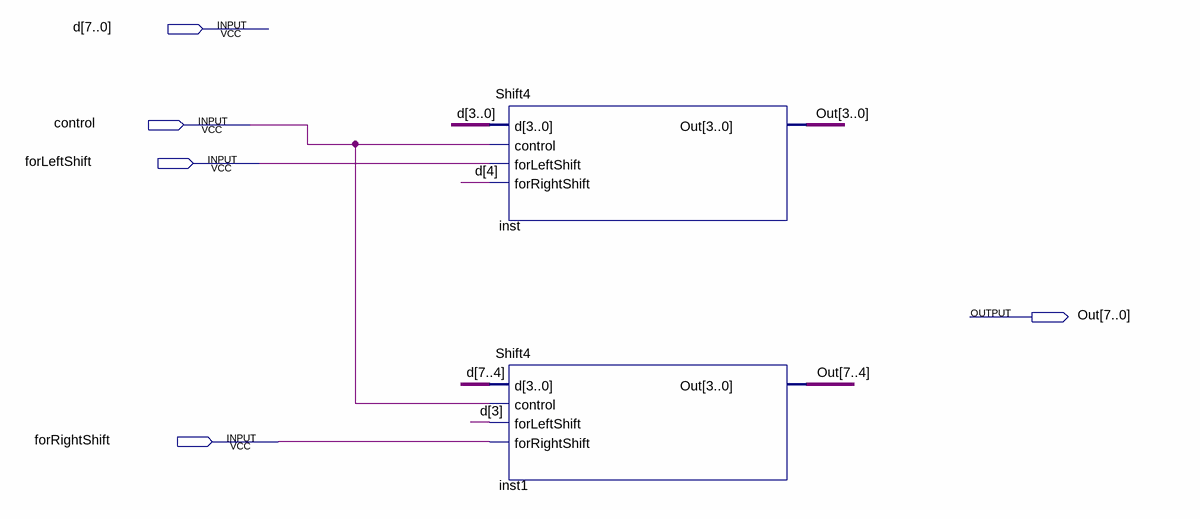
[diagram p0: schematic sheet]
// Quartus schematic Shift8.bdf as structural Verilog: 2 symbols, 5 pins
module Shift8 (
  input  [7:0] d,
  input  control,
  input  forLeftShift,
  input  forRightShift,
  output [7:0] Out
);

  Shift4 inst (.d(d[3:0]), .control(control), .forLeftShift(forLeftShift), .forRightShift(d[4]), .Out(Out[3:0]));
  Shift4 inst1 (.d(d[7:4]), .control(control), .forLeftShift(d[3]), .forRightShift(forRightShift), .Out(Out[7:4]));
endmodule
